# Altium project CAN_Bus.PrjPCB
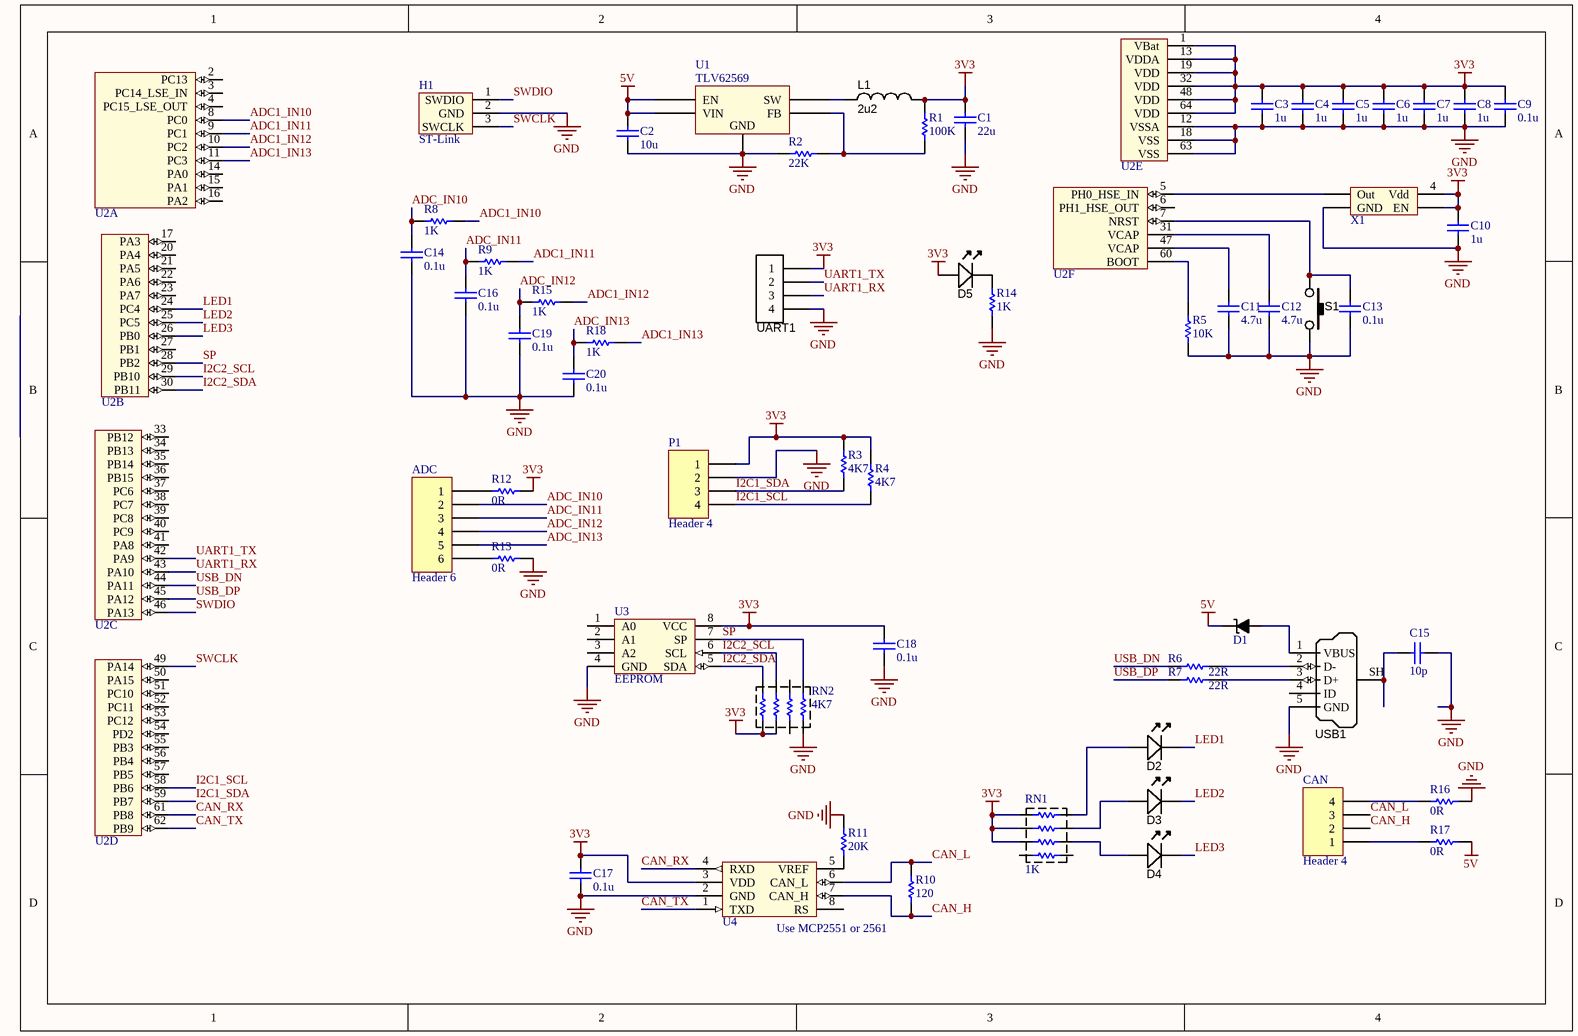
[diagram p0: STM32F405.SchDoc]
1 sheet, 58 parts. Net scope: global (net labels, ports and power ports of the same name join across sheets).
Board file: usb_to_can.PcbDoc

## Sheet STM32F405.SchDoc
size A4

### Parts
ADC  Header 6  [HDR1X6]
C1  value 22u  [CAPC2012X135N]  (hidden comment: Cap)
C2  value 10u  [CAPC2012X135N]  (hidden comment: Cap)
C3  value 1u  [CAPC1608X90N]  (hidden comment: Cap)
C4  value 1u  [CAPC1608X90N]  (hidden comment: Cap)
C5  value 1u  [CAPC1608X90N]  (hidden comment: Cap)
C6  value 1u  [CAPC1608X90N]  (hidden comment: Cap)
C7  value 1u  [CAPC1608X90N]  (hidden comment: Cap)
C8  value 1u  [CAPC1608X90N]  (hidden comment: Cap)
C9  value 0.1u  [CAPC1608X90N]  (hidden comment: Cap)
C10  value 1u  [CAPC1608X90N]  (hidden comment: Cap)
C11  value 4.7u  [CAPC1608X90N]  (hidden comment: Cap)
C12  value 4.7u  [CAPC1608X90N]  (hidden comment: Cap)
C13  value 0.1u  [CAPC1608X90N]  (hidden comment: Cap)
C14  value 0.1u  [CAPC1608X90N]  (hidden comment: Cap)
C15  value 10p  [CAPC1608X90N]  (hidden comment: Cap)
C16  value 0.1u  [CAPC1608X90N]  (hidden comment: Cap)
C17  value 0.1u  [CAPC1608X90N]  (hidden comment: Cap)
C18  value 0.1u  [CAPC1608X90N]  (hidden comment: Cap)
C19  value 0.1u  [CAPC1608X90N]  (hidden comment: Cap)
C20  value 0.1u  [CAPC1608X90N]  (hidden comment: Cap)
CAN  Header 4  [1X4_HDR_2.00mm_PH]
D1  diode  [DIODE_3216_70N]  (value not drawn)
D2  LED_Green_GullWing  [LED-0805-A]  (value not drawn)
D3  LED_Green_GullWing  [LED-0805-A]  (value not drawn)
D4  LED_Green_GullWing  [LED-0805-A]  (value not drawn)
D5  LED_Green_GullWing  [LED-0805-A]  (value not drawn)
H1  ST-Link  [1x3POS_HEADER]
L1  value 2u2  [INDM3225X240N]  (hidden comment: inductor)
P1  Header 4  [HDR1X4]
R1  value 100K  [RESC2012X70N]  (hidden comment: Res1)
R2  value 22K  [RESC2012X70N]  (hidden comment: Res1)
R3  value 4K7  [RESC1608X55N]  (hidden comment: Res1)
R4  value 4K7  [RESC1608X55N]  (hidden comment: Res1)
R5  value 10K  [RESC1608X55N]  (hidden comment: Res1)
R6  value 22R  [RESC1608X55N]  (hidden comment: Res1)
R7  value 22R  [RESC1608X55N]  (hidden comment: Res1)
R8  value 1K  [RESC1608X55N]  (hidden comment: Res1)
R9  value 1K  [RESC1608X55N]  (hidden comment: Res1)
R10  value 120  [RESC1608X55N]  (hidden comment: Res1)
R11  value 20K  [RESC1608X55N]  (hidden comment: Res1)
R12  value 0R  [RESC1608X55N]  (hidden comment: Res1)
R13  value 0R  [RESC1608X55N]  (hidden comment: Res1)
R14  value 1K  [RESC1608X55N]  (hidden comment: Res1)
R15  value 1K  [RESC1608X55N]  (hidden comment: Res1)
R16  value 0R  [RESC1608X55N]  (hidden comment: Res1)
R17  value 0R  [RESC1608X55N]  (hidden comment: Res1)
R18  value 1K  [RESC1608X55N]  (hidden comment: Res1)
RN1  value 1K  [RESCAXS50P160X320X70-8N]  (hidden comment: resistor network)
RN2  value 4K7  [RESCAXS50P160X320X70-8N]  (hidden comment: resistor network)
S1  SW_THT_PB_4.3mm  [TACT_SWT-SMD-4.4]  (value not drawn)
U1  TLV62569  [SOT23-5]
U2  STM32F405RE  [LQFP64]  (value not drawn)  (parts A,B,C,D,E,F of 6)
U3  EEPROM  [SOP8]
U4  SN65HVD23x  [SOIC127P600X175-8AN]  (value not drawn)
UART1  Programmer  [1X4_HDR_2.00mm_PH]  (value not drawn)  (no BOM)
USB1  USB Micro Type B  [USB_MICRO-B]  (value not drawn)
X1  ASE-8.000MHZ-LC-T  [ASE Series]  (value not drawn)

### Nets
3V3: C1.2 C3.2 C4.2 C5.2 C6.2 C7.2 C8.2 C9.2 C10.2 C17.2 C18.1 D5.A L1.2 P1.1 R1.2 R3.2 R4.2 R12.2 RN1.1 RN1.2 RN1.3 RN2.1 RN2.2 U2.1(VBat) U2.13(VDDA) U2.19(VDD) U2.32(VDD) U2.48(VDD) U2.64(VDD) U3.8(VCC) U4.3(VDD) UART1.1 X1.1(EN) X1.4(Vdd)
5V: C2.2 D1.K(Cathode) R17.2 U1.1(EN) U1.4(VIN)
GND: C1.1 C2.1 C3.1 C4.1 C5.1 C6.1 C7.1 C8.1 C9.1 C10.1 C11.1 C12.1 C13.1 C14.1 C15.2 C16.1 C17.1 C18.2 C19.1 C20.1 H1.2(GND) P1.2 R2.1 R5.1 R11.1 R13.2 R14.2 R16.2 RN2.4 S1.2 U1.2(GND) U2.12(VSSA) U2.18(VSS) U2.63(VSS) U3.4(GND) U4.2(GND) UART1.4 USB1.5(GND) X1.2(GND)
ADC1_IN10: R8.1 U2.8(PC0)
ADC1_IN11: R9.1 U2.9(PC1)
ADC1_IN12: R15.1 U2.10(PC2)
ADC1_IN13: R18.1 U2.11(PC3)
ADC_IN10: ADC.2 C14.2 R8.2
ADC_IN11: ADC.3 C16.2 R9.2
ADC_IN12: ADC.4 C19.2 R15.2
ADC_IN13: ADC.5 C20.2 R18.2
CAN_H: CAN.2 R10.1 U4.7(CAN_H)
CAN_L: CAN.3 R10.2 U4.6(CAN_L)
CAN_RX: U2.61(PB8) U4.4(RXD)
CAN_TX: U2.62(PB9) U4.1(TXD)
I2C1_SCL: P1.4 R4.1 U2.58(PB6)
I2C1_SDA: P1.3 R3.1 U2.59(PB7)
I2C2_SCL: RN2.7 U2.29(PB10) U3.6(SCL)
I2C2_SDA: RN2.8 U2.30(PB11) U3.5(SDA)
LED1: D2.K U2.24(PC4)
LED2: D3.K U2.25(PC5)
LED3: D4.K U2.26(PB0)
SP: RN2.5 U2.28(PB2) U3.7(SP)
SWCLK: H1.3(SWCLK) U2.49(PA14)
SWDIO: H1.1(SWDIO) U2.46(PA13)
UART1_RX: U2.43(PA10) UART1.3
UART1_TX: U2.42(PA9) UART1.2
USB_DN: R6.1 U2.44(PA11)
USB_DP: R7.1 U2.45(PA12)
NetADC_1: ADC.1 R12.1
NetADC_6: ADC.6 R13.1
NetC11_2: C11.2 U2.47(VCAP)
NetC12_2: C12.2 U2.31(VCAP)
NetC13_2: C13.2 S1.1 U2.7(NRST)
NetC15_1: C15.1 USB1.SH(Shell)
NetCAN_1: CAN.1 R17.1
NetCAN_4: CAN.4 R16.1
NetD1_A: D1.A(Anode) USB1.1(VBUS)
NetD2_A: D2.A RN1.8
NetD3_A: D3.A RN1.7
NetD4_A: D4.A RN1.6
NetD5_K: D5.K R14.1
NetL1_1: L1.1 U1.3(SW)
NetR1_1: R1.1 R2.2 U1.5(FB)
NetR5_2: R5.2 U2.60(BOOT)
NetR6_2: R6.2 USB1.2(D-)
NetR7_2: R7.2 USB1.3(D+)
NetR11_2: R11.2 U4.5(VREF)
NetU2_5: U2.5(PH0_HSE_IN) X1.3(Out)

Not connected (* = marked no-connect by the designer): RN1 4 5; RN2 3 6; U2 2(PC13) 3(PC14_LSE_IN) 4(PC15_LSE_OUT) 6(PH1_HSE_OUT) 14(PA0) 15(PA1) 16(PA2) 17(PA3) 20(PA4) 21(PA5) 22(PA6) 23(PA7) 27(PB1) 33(PB12) 34(PB13) 35(PB14) 36(PB15) 37(PC6) 38(PC7) 39(PC8) 40(PC9) 41(PA8) 50(PA15) 51(PC10) 52(PC11) 53(PC12) 54(PD2) 55(PB3) 56(PB4) 57(PB5); U3 1(A0) 2(A1) 3(A2); U4 8(RS); USB1 4(ID)

### Notes on the sheet
- (near U4) Use MCP2551 or 2561

### Library data of the parts
ADC = Header 6: Header, 6-Pin; LatestRevisionDate: 17-Jul-2002; LatestRevisionNote: Re-released for DXP Platform.; Publisher: Altium Limited
C1-C20 = Cap: Capacitor; Published: 8-Jun-2000; LatestRevisionDate: 17-Jul-2002; LatestRevisionNote: Re-released for DXP Platform.; PackageReference: RAD-0.3; Publisher: Altium Limited; PackageDescription: Radial Cap, Thru-Hole; 2 Leads; 0.3 in Pin Spacing
CAN P1 = Header 4: Header, 4-Pin; LatestRevisionDate: 17-Jul-2002; LatestRevisionNote: Re-released for DXP Platform.; Publisher: Altium Limited
D1 = SD1206S040S2R0: 100V 1A; ComponentLink1Description: mouser; ComponentLink1URL: https://www.mouser.hk/ProductDetail/AVX/SD1206S040S2R0?qs=jCA%252BPfw4LHbfEJl0sZ31oA%3D%3D
D2-D5 = LED_Green_GullWing: LED Gull-wing SMD High-intensity Green 450mcd 574nm; Manufacturer 1: Ligitek; Manufacturer Part Number 1: L8UG9033/TR1; Ratings: 450 mcd; 574 nm; Material: AlGaInP; SCDType: source; Package / Case: 4.6mm Gull-Wing; Color: Green
H1 = ST-Link: ST-Link header with silkscreen
L1 = INDC: IHLP SMD 4040; link: http://www.mouser.hk/ProductDetail/Panasonic/ETQ-P5M4R7YFC/?qs=sGAEpiMZZMsg%252by3WlYCkUx1BJssUTVH58rrEHsPkNus%3d
R1-R18 = Res1: Resistor; Published: 8-Jun-2000; LatestRevisionDate: 17-Jul-2002; LatestRevisionNote: Re-released for DXP Platform.; PackageReference: AXIAL-0.3; Publisher: Altium Limited; PackageDescription: Axial Device, Thru-Hole; 2 Leads; 0.3 in Pin Spacing
RN1 RN2 = RES_NET
S1 = SW_THT_PB_4.3mm: Switch, tact, 4.3mm stem; Manufacturer 1: Bond-Tact; Manufacturer Part Number 1: TS-1143-WP-300; SCDType: spec; Function: Speed; Package / Case: 6.5x6.5mm; 4.3mm stem; Material: Brass/Nylon/Ag plating
U1 = TLV62569: 2-A High Efficiency Synchronous Buck Converter in SOT Package; Manufacturer: TI; Vin: 2.5-5.5V; Iout(max): 2A
U2 = STM32F405RE: STM32F405RE 64 pin package, Cortex M4 core with up to
U3 = AT24C64: 64K EEPROM
U4 = SN65HVD23x: SN65HVD23x 3.3-V CAN Bus Transceivers; ComponentLink1Description: Datasheet; ComponentLink1URL: https://www.ti.com/lit/ds/symlink/sn65hvd230.pdf?ts=1604457324049&ref_url=https%253A%252F%252Fwww.google.com%252F
UART1 = Header4P: Header 4-pin
USB1 = USB_Micro_TypeB: Connector SMD USB Micro Type B middle mount; Manufacturer 1: Molex Inc; Manufacturer Part Number 1: 47491-0001; SCDType: undef; Package / Case: SMD; Supplier 1: Digi-Key; Supplier Part Number 1: WM17142CT-ND
X1 = ASE-8.000MHZ-LC-T: 8MHz; ComponentLink1Description: Datasheet; ComponentLink1URL: https://www.mouser.hk/ProductDetail/ABRACON/ASE-8000MHZ-LC-T?qs=ShQ8XZQtgRsRMJ3lmGY0Sw%3D%3D